# Altium schematic sheet RFFE.SchDoc
size A3
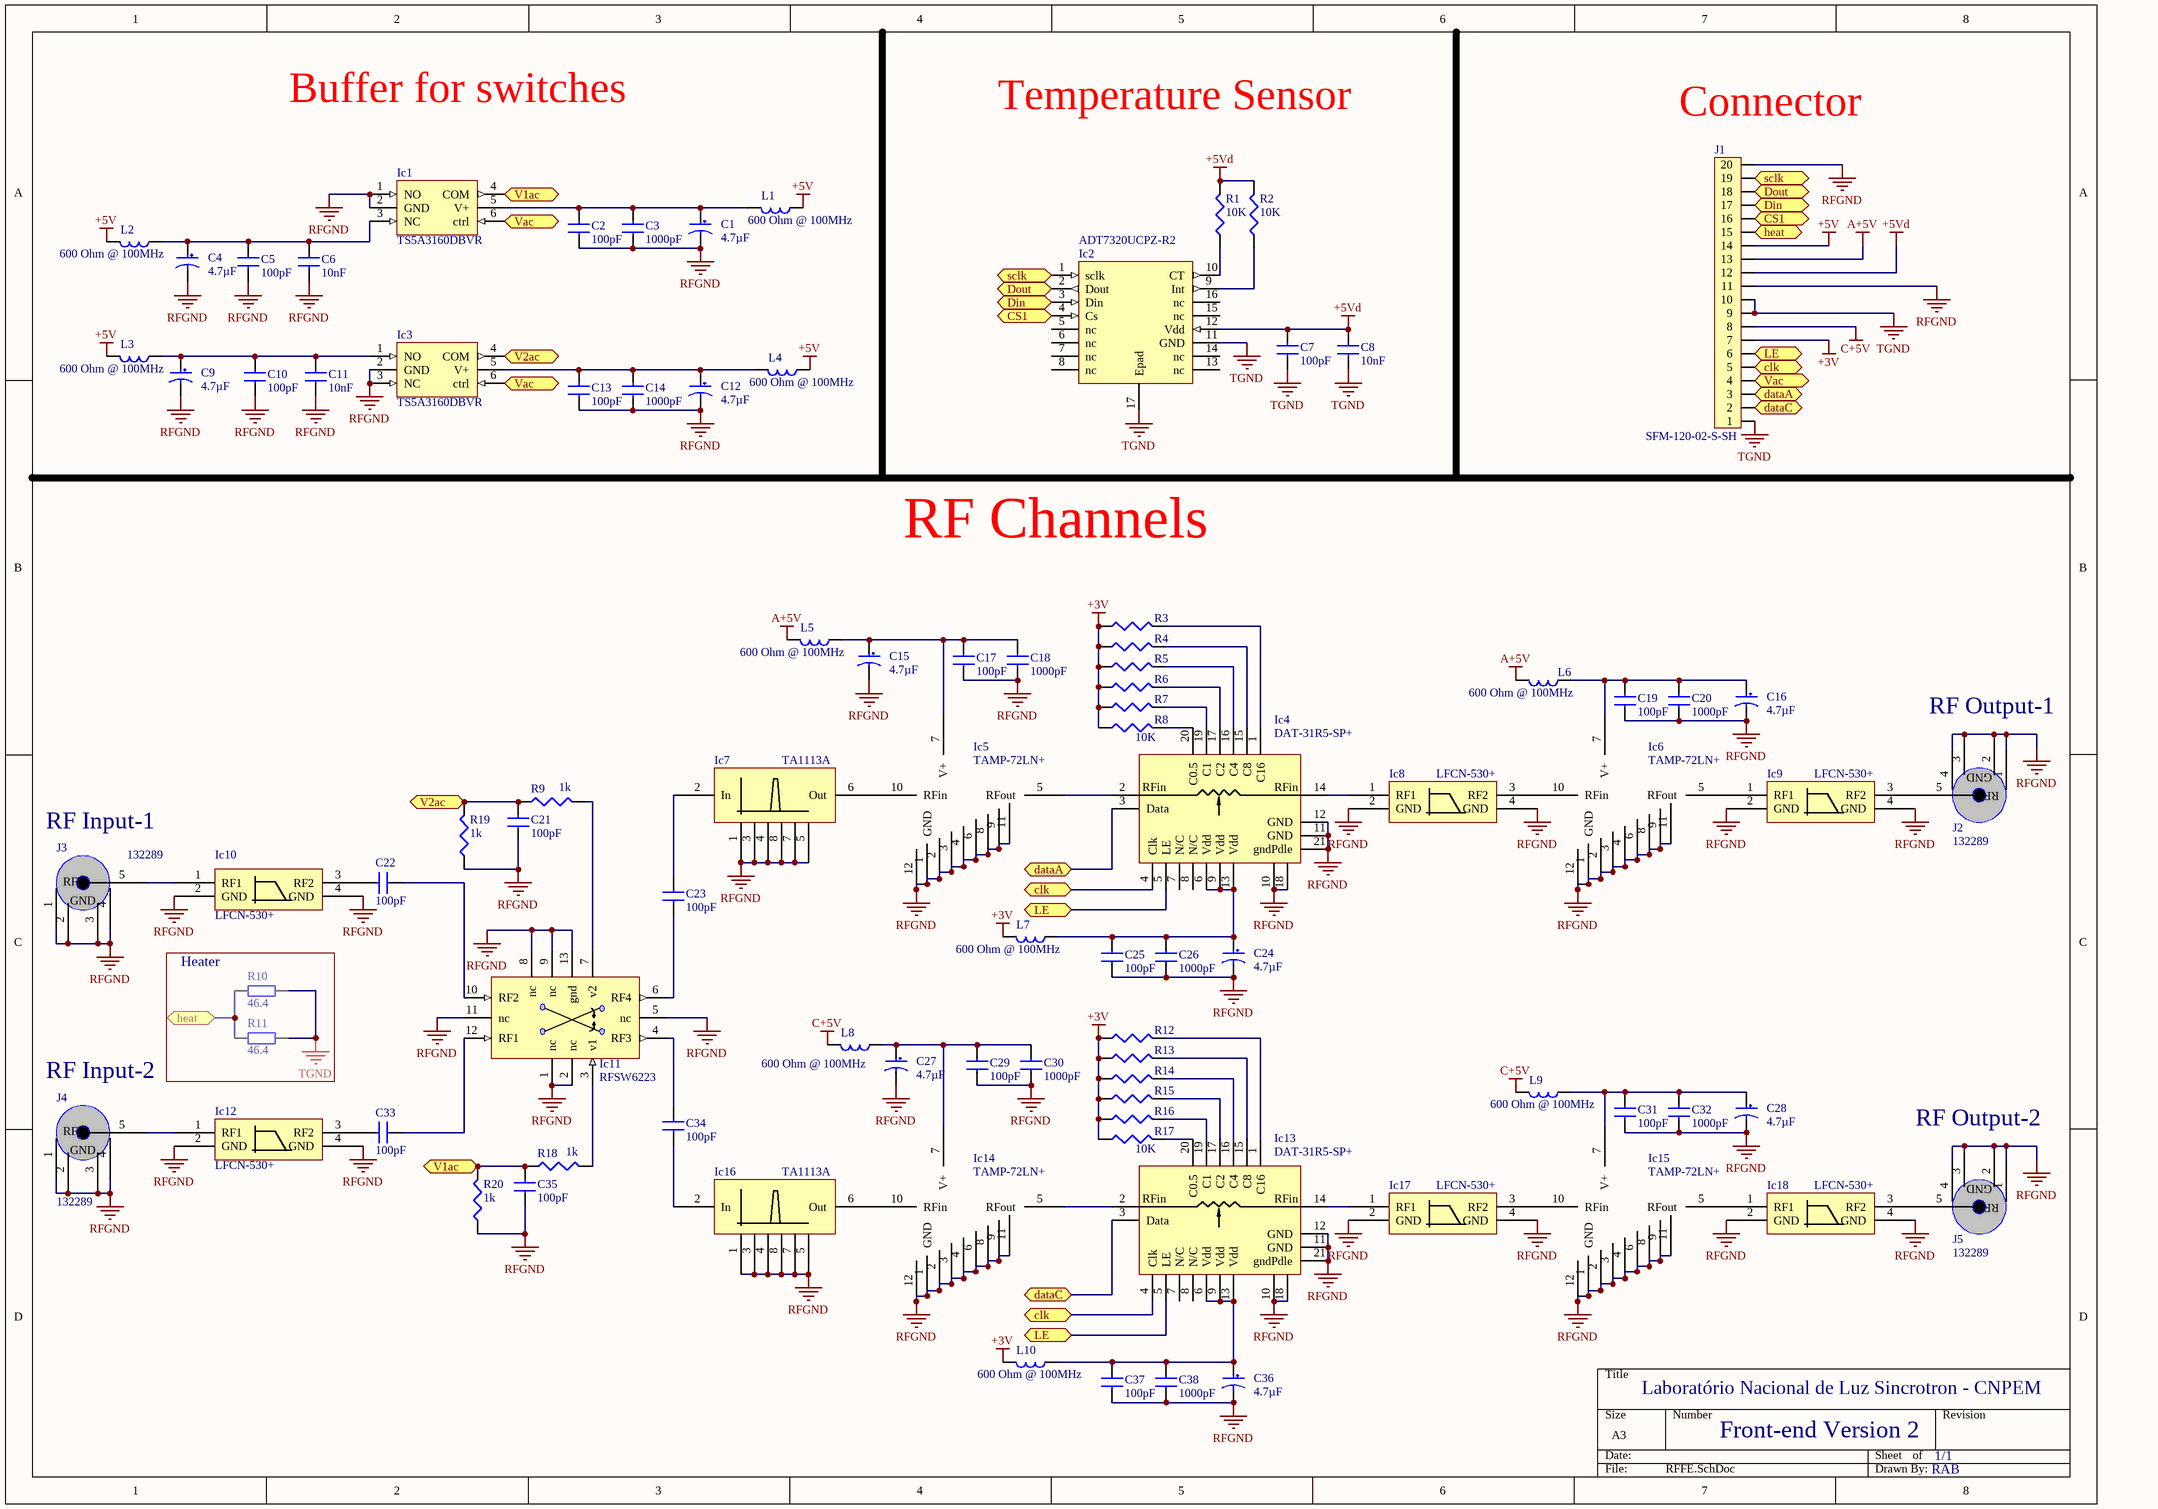
[diagram p0: RFFE.SchDoc]

## Parts
C1  Capacitance: 4.7µF  [CAPC3528M]  (hidden comment: CAP TANT 4.7UF)
C2  Capacitance: 100pF  [CAPC1608M]  (hidden comment: C1608C0G1H101J)
C3  Capacitance: 1000pF  [CAPC1608M]  (hidden comment: C1608C0G1H102J)
C4  Capacitance: 4.7µF  [CAPC3528M]  (hidden comment: CAP TANT 4.7UF)
C5  Capacitance: 100pF  [CAPC1005M]  (hidden comment: UMK105CG101JV-F)
C6  Capacitance: 10nF  [CAPC2012M]  (hidden comment: CAP CER 10000PF)
C7  Capacitance: 100pF  [CAPC1608N]  (hidden comment: C1608C0G1H101J)
C8  Capacitance: 10nF  [CAPC2012M]  (hidden comment: CAP CER 10000PF)
C9  Capacitance: 4.7µF  [CAPC3528M]  (hidden comment: CAP TANT 4.7UF)
C10  Capacitance: 100pF  [CAPC1005M]  (hidden comment: UMK105CG101JV-F)
C11  Capacitance: 10nF  [CAPC2012M]  (hidden comment: CAP CER 10000PF)
C12  Capacitance: 4.7µF  [CAPC3528M]  (hidden comment: CAP TANT 4.7UF)
C13  Capacitance: 100pF  [CAPC1608M]  (hidden comment: C1608C0G1H101J)
C14  Capacitance: 1000pF  [CAPC1608M]  (hidden comment: C1608C0G1H102J)
C15  Capacitance: 4.7µF  [CAPC3528M]  (hidden comment: CAP TANT 4.7UF)
C16  Capacitance: 4.7µF  [CAPC3528M]  (hidden comment: CAP TANT 4.7UF)
C17  Capacitance: 100pF  [CAPC1608N]  (hidden comment: C1608C0G1H101J)
C18  Capacitance: 1000pF  [CAPC1608M]  (hidden comment: C1608C0G1H102J)
C19  Capacitance: 100pF  [CAPC1608N]  (hidden comment: C1608C0G1H101J)
C20  Capacitance: 1000pF  [CAPC1608M]  (hidden comment: C1608C0G1H102J)
C21  Capacitance: 100pF  [CAPC1608N]  (hidden comment: C1608C0G1H101J)
C22  Capacitance: 100pF  [CAPC1005N]  (hidden comment: UMK105CG101JV-F)
C23  Capacitance: 100pF  [CAPC1005N]  (hidden comment: UMK105CG101JV-F)
C24  Capacitance: 4.7µF  [CAPC3528M]  (hidden comment: CAP TANT 4.7UF)
C25  Capacitance: 100pF  [CAPC1608N]  (hidden comment: C1608C0G1H101J)
C26  Capacitance: 1000pF  [CAPC1608M]  (hidden comment: C1608C0G1H102J)
C27  Capacitance: 4.7µF  [CAPC3528M]  (hidden comment: CAP TANT 4.7UF)
C28  Capacitance: 4.7µF  [CAPC3528M]  (hidden comment: CAP TANT 4.7UF)
C29  Capacitance: 100pF  [CAPC1608N]  (hidden comment: C1608C0G1H101J)
C30  Capacitance: 1000pF  [CAPC1608M]  (hidden comment: C1608C0G1H102J)
C31  Capacitance: 100pF  [CAPC1608N]  (hidden comment: C1608C0G1H101J)
C32  Capacitance: 1000pF  [CAPC1608M]  (hidden comment: C1608C0G1H102J)
C33  Capacitance: 100pF  [CAPC1005N]  (hidden comment: UMK105CG101JV-F)
C34  Capacitance: 100pF  [CAPC1005N]  (hidden comment: UMK105CG101JV-F)
C35  Capacitance: 100pF  [CAPC1608N]  (hidden comment: C1608C0G1H101J)
C36  Capacitance: 4.7µF  [CAPC3528M]  (hidden comment: CAP TANT 4.7UF)
C37  Capacitance: 100pF  [CAPC1608N]  (hidden comment: C1608C0G1H101J)
C38  Capacitance: 1000pF  [CAPC1608M]  (hidden comment: C1608C0G1H102J)
Ic1  TS5A3160DBVR  [TSOP95P280X145-6N]
Ic2  ADT7320UCPZ-R2  [QFN127P600-8N]
Ic3  TS5A3160DBVR  [TSOP95P280X145-6N]
Ic4  DAT-31R5-SP+  [DG983-1]
Ic5  TAMP-72LN+  [JQ1382]
Ic6  TAMP-72LN+  [JQ1382]
Ic7  TA1113A  [TST-TA1114A]
Ic8  LFCN-530+  [FV1206]
Ic9  LFCN-530+  [FV1206]
Ic10  LFCN-530+  [FV1206]
Ic11  RFSW6223  [QFN50P300X300X85_HS-13N1]
Ic12  LFCN-530+  [FV1206]
Ic13  DAT-31R5-SP+  [DG983-1]
Ic14  TAMP-72LN+  [JQ1382]
Ic15  TAMP-72LN+  [JQ1382]
Ic16  TA1113A  [TST-TA1114A]
Ic17  LFCN-530+  [FV1206]
Ic18  LFCN-530+  [FV1206]
J1  SFM-120-02-S-SH  [SFM-120-02-S-SH]
J2  132289  [SMAedge50R]
J3  132289  [SMAedge50R]
J4  132289  [SMAedge50R]
J5  132289  [SMAedge50R]
L1  Impedance @ Frequency: 600 Ohm @ 100MHz  [CAPC1608M]  (hidden comment: BLM18HE601SN1D)
L2  Impedance @ Frequency: 600 Ohm @ 100MHz  [CAPC1608M]  (hidden comment: BLM18HE601SN1D)
L3  Impedance @ Frequency: 600 Ohm @ 100MHz  [CAPC1608M]  (hidden comment: BLM18HE601SN1D)
L4  Impedance @ Frequency: 600 Ohm @ 100MHz  [CAPC1608M]  (hidden comment: BLM18HE601SN1D)
L5  Impedance @ Frequency: 600 Ohm @ 100MHz  [CAPC1608M]  (hidden comment: BLM18HE601SN1D)
L6  Impedance @ Frequency: 600 Ohm @ 100MHz  [CAPC1608M]  (hidden comment: BLM18HE601SN1D)
L7  Impedance @ Frequency: 600 Ohm @ 100MHz  [CAPC1608M]  (hidden comment: BLM18HE601SN1D)
L8  Impedance @ Frequency: 600 Ohm @ 100MHz  [CAPC1608M]  (hidden comment: BLM18HE601SN1D)
L9  Impedance @ Frequency: 600 Ohm @ 100MHz  [CAPC1608M]  (hidden comment: BLM18HE601SN1D)
L10  Impedance @ Frequency: 600 Ohm @ 100MHz  [CAPC1608M]  (hidden comment: BLM18HE601SN1D)
R1  Resistance (Ohms): 10K  [RESC1608N]  (hidden comment: PNM0603E1002BST5)
R2  Resistance (Ohms): 10K  [RESC1608N]  (hidden comment: PNM0603E1002BST5)
R3  ERJ-3GEYJ103V  [RESC1608N]  (value not drawn)
R4  ERJ-3GEYJ103V  [RESC1608N]  (value not drawn)
R5  ERJ-3GEYJ103V  [RESC1608N]  (value not drawn)
R6  ERJ-3GEYJ103V  [RESC1608N]  (value not drawn)
R7  ERJ-3GEYJ103V  [RESC1608N]  (value not drawn)
R8  Resistance (Ohms): 10K  [RESC1608N]  (hidden comment: ERJ-3GEYJ103V)
R9  Resistance (Ohms): 1k  [RESC1005L]  (hidden comment: ERJ-2GEJ102X)
R10  Resistance (Ohms): 46.4  [AXIAL9.0]  (hidden comment: CMF5546R400FHEB)
R11  Resistance (Ohms): 46.4  [AXIAL9.0]  (hidden comment: CMF5546R400FHEB)
R12  ERJ-3GEYJ103V  [RESC1608N]  (value not drawn)
R13  ERJ-3GEYJ103V  [RESC1608N]  (value not drawn)
R14  ERJ-3GEYJ103V  [RESC1608N]  (value not drawn)
R15  ERJ-3GEYJ103V  [RESC1608N]  (value not drawn)
R16  ERJ-3GEYJ103V  [RESC1608N]  (value not drawn)
R17  Resistance (Ohms): 10K  [RESC1608N]  (hidden comment: ERJ-3GEYJ103V)
R18  Resistance (Ohms): 1k  [RESC1005L]  (hidden comment: ERJ-2GEJ102X)
R19  Resistance (Ohms): 1k  [RESC1005L]  (hidden comment: ERJ-2GEJ102X)
R20  Resistance (Ohms): 1k  [RESC1005L]  (hidden comment: ERJ-2GEJ102X)

## Blocks framed on the sheet
Heater: R10 R11

## Ports
clk, CS1, dataA, dataC, Din, Dout, heat, LE, sclk, V1ac, V2ac, Vac

## Nets
+3V: J1.7 L7.2 L10.2 R3.2 R4.2 R5.2 R6.2 R7.2 R8.2 R12.2 R13.2 R14.2 R15.2 R16.2 R17.2
+5V: J1.14 L1.1 L2.2 L3.2 L4.1
+5Vd: C7.2 C8.1 Ic2.12(Vdd) J1.12 R1.1 R2.1
A+5V: J1.13 L5.2 L6.2
C+5V: J1.8 L8.2 L9.2
RFGND: C1.2 C2.1 C3.2 C4.2 C5.2 C6.2 C9.2 C10.2 C11.2 C12.2 C13.1 C14.2 C15.2 C16.2 C17.1 C18.2 C19.1 C20.2 C21.1 C24.2 C25.1 C26.2 C27.2 C28.2 C29.1 C30.2 C31.1 C32.2 C35.1 C36.2 C37.1 C38.2 Ic1.1(NO) Ic1.2(GND) Ic3.2(GND) Ic3.3(NC) Ic4.10(GND) Ic4.11(GND) Ic4.12(GND) Ic4.18(GND) Ic4.21(gndPdle) Ic5.1(GND) Ic5.2(GND) Ic5.3(GND) Ic5.4(GND) Ic5.6(GND) Ic5.8(GND) Ic5.9(GND) Ic5.11(GND) Ic5.12(GND) Ic6.1(GND) Ic6.2(GND) Ic6.3(GND) Ic6.4(GND) Ic6.6(GND) Ic6.8(GND) Ic6.9(GND) Ic6.11(GND) Ic6.12(GND) Ic7.1(GND) Ic7.3(GND) Ic7.4(GND) Ic7.5(GND) Ic7.7(GND) Ic7.8(GND) Ic8.2(GND) Ic8.4(GND) Ic9.2(GND) Ic9.4(GND) Ic10.2(GND) Ic10.4(GND) Ic11.1(nc) Ic11.2(nc) Ic11.5(nc) Ic11.8(nc) Ic11.9(nc) Ic11.11(nc) Ic11.13(gnd) Ic12.2(GND) Ic12.4(GND) Ic13.10(GND) Ic13.11(GND) Ic13.12(GND) Ic13.18(GND) Ic13.21(gndPdle) Ic14.1(GND) Ic14.2(GND) Ic14.3(GND) Ic14.4(GND) Ic14.6(GND) Ic14.8(GND) Ic14.9(GND) Ic14.11(GND) Ic14.12(GND) Ic15.1(GND) Ic15.2(GND) Ic15.3(GND) Ic15.4(GND) Ic15.6(GND) Ic15.8(GND) Ic15.9(GND) Ic15.11(GND) Ic15.12(GND) Ic16.1(GND) Ic16.3(GND) Ic16.4(GND) Ic16.5(GND) Ic16.7(GND) Ic16.8(GND) Ic17.2(GND) Ic17.4(GND) Ic18.2(GND) Ic18.4(GND) J1.11 J1.20 J2.1(GND) J2.2(GND) J2.3(GND) J2.4(GND) J3.1(GND) J3.2(GND) J3.3(GND) J3.4(GND) J4.1(GND) J4.2(GND) J4.3(GND) J4.4(GND) J5.1(GND) J5.2(GND) J5.3(GND) J5.4(GND) R19.2 R20.2
TGND: C7.1 C8.2 Ic2.11(GND) Ic2.17(Epad) J1.1 J1.9 J1.10 R10.1 R11.1
clk: Ic4.4(Clk) Ic13.4(Clk) J1.5 ; port clk
CS1: Ic2.4(Cs) J1.16 ; port CS1
dataA: Ic4.3(Data) J1.3 ; port dataA
dataC: Ic13.3(Data) J1.2 ; port dataC
Din: Ic2.3(Din) J1.17 ; port Din
Dout: Ic2.2(Dout) J1.18 ; port Dout
heat: J1.15 R10.2 R11.2 ; port heat
LE: Ic4.5(LE) Ic13.5(LE) J1.6 ; port LE
sclk: Ic2.1(sclk) J1.19 ; port sclk
V1ac: C35.2 Ic1.4(COM) R18.2 R20.1 ; port V1ac
V2ac: C21.2 Ic3.4(COM) R9.2 R19.1 ; port V2ac
Vac: Ic1.6(ctrl) Ic3.6(ctrl) J1.4 ; port Vac
NetC1_1: C1.1 C2.2 C3.1 Ic1.5(V+) L1.2
NetC4_1: C4.1 C5.1 C6.1 Ic1.3(NC) L2.1
NetC9_1: C9.1 C10.1 C11.1 Ic3.1(NO) L3.1
NetC12_1: C12.1 C13.2 C14.1 Ic3.5(V+) L4.2
NetC15_1: C15.1 C17.2 C18.1 Ic5.7(V+) L5.1
NetC16_1: C16.1 C19.2 C20.1 Ic6.7(V+) L6.1
NetC22_1: C22.1 Ic10.3(RF2)
NetC22_2: C22.2 Ic11.10(RF2)
NetC23_1: C23.1 Ic7.2(In)
NetC23_2: C23.2 Ic11.6(RF4)
NetC24_1: C24.1 C25.2 C26.1 Ic4.6(Vdd) Ic4.9(Vdd) Ic4.13(Vdd) L7.1
NetC27_1: C27.1 C29.2 C30.1 Ic14.7(V+) L8.1
NetC28_1: C28.1 C31.2 C32.1 Ic15.7(V+) L9.1
NetC33_1: C33.1 Ic12.3(RF2)
NetC33_2: C33.2 Ic11.12(RF1)
NetC34_1: C34.1 Ic11.4(RF3)
NetC34_2: C34.2 Ic16.2(In)
NetC36_1: C36.1 C37.2 C38.1 Ic13.6(Vdd) Ic13.9(Vdd) Ic13.13(Vdd) L10.1
NetIc2_9: Ic2.9(Int) R2.2
NetIc2_10: Ic2.10(CT) R1.2
NetIc4_1: Ic4.1(C16) R3.1
NetIc4_2: Ic4.2(RFin) Ic5.5(RFout)
NetIc4_14: Ic4.14(RFout) Ic8.1(RF1)
NetIc4_15: Ic4.15(C8) R4.1
NetIc4_16: Ic4.16(C4) R5.1
NetIc4_17: Ic4.17(C2) R6.1
NetIc4_19: Ic4.19(C1) R7.1
NetIc4_20: Ic4.20(C0.5) R8.1
NetIc5_10: Ic5.10(RFin) Ic7.6(Out)
NetIc6_5: Ic6.5(RFout) Ic9.1(RF1)
NetIc6_10: Ic6.10(RFin) Ic8.3(RF2)
NetIc9_3: Ic9.3(RF2) J2.5(RFin)
NetIc10_1: Ic10.1(RF1) J3.5(RFin)
NetIc11_3: Ic11.3(v1) R18.1
NetIc11_7: Ic11.7(v2) R9.1
NetIc12_1: Ic12.1(RF1) J4.5(RFin)
NetIc13_1: Ic13.1(C16) R12.1
NetIc13_2: Ic13.2(RFin) Ic14.5(RFout)
NetIc13_14: Ic13.14(RFout) Ic17.1(RF1)
NetIc13_15: Ic13.15(C8) R13.1
NetIc13_16: Ic13.16(C4) R14.1
NetIc13_17: Ic13.17(C2) R15.1
NetIc13_19: Ic13.19(C1) R16.1
NetIc13_20: Ic13.20(C0.5) R17.1
NetIc14_10: Ic14.10(RFin) Ic16.6(Out)
NetIc15_5: Ic15.5(RFout) Ic18.1(RF1)
NetIc15_10: Ic15.10(RFin) Ic17.3(RF2)
NetIc18_3: Ic18.3(RF2) J5.5(RFin)

Not connected (* = marked no-connect by the designer): Ic2 5(nc) 6(nc) 7(nc) 8(nc) 13(nc) 14(nc) 15(nc) 16(nc); Ic4 7(N/C) 8(N/C); Ic5 0(GND); Ic6 0(GND); Ic13 7(N/C) 8(N/C); Ic14 0(GND); Ic15 0(GND)

## Notes on the sheet
- Buffer for switches
- Temperature Sensor
- (near J1) Connector
- RF Channels
- RF Output-1
- RF Input-1
- RF Input-2
- RF Output-2
- Laboratório Nacional de Luz Sincrotron - CNPEM
- Front-end Version 2
- 1/1
- RAB
- (in symbol 132289) RF

## Library data of the parts
C1 C4 C9 C12 C15 C16 C24 C27 C28 C36 = T495B475K016ZTE800: CAP TANT 4.7UF 16V 10% 1411; Manufacturer: Kemet; Manufacturer Size Code: B; ESR (Equivalent Series Resistance): 800.0 mOhm; Type: Molded; Supplier 1: Digi-Key; Manufacturer Part Number: T495B475K016ZTE800; RoHS: RoHS Compliant; Category: Capacitors; Stock 1: 4639; Pricing 1: 1=2.2, 10=1.804, 25=1.628, 100=1.452, 250=1.276, 500=1.188, 1000=0.924 (USD); Voltage - Rated: 16V; Tolerance: ±10%; Operating Temperature: -55°C ~ 125°C; Mounting Type: Surface Mount; Package / Case: 1411 (3528 Metric); Size / Dimension: 0.138" L x 0.110" W (3.50mm x 2.80mm); Height - Seated (Max): 0.083" (2.10mm); Lead Spacing: -; Features: General Purpose; Packaging: Cut Tape (CT); Lifetime @ Temp.: -; ComponentLink1URL: http://www.kemet.com/datasheets&T495B475K016ZTE800; ComponentLink1Description: http://www.kemet.com/datasheets&T495B475K016ZTE800; Supplier Part Number 1: 399-5191-1-ND
C2 C7 C13 C17 C19 C21 C25 C29 C31 C35 C37 = C1608C0G1H101J: CAP CER 100PF 50V 5% NP0 0603; Manufacturer: TDK Corporation; Temperature Coefficient: C0G, NP0; Supplier 1: Digi-Key; Manufacturer Part Number: C1608C0G1H101J; RoHS: RoHS Compliant; Category: Capacitors; Stock 1: 926382; Pricing 1: 1=0.09, 10=0.055, 100=0.0198, 250=0.01432, 500=0.01056, 1000=0.00715 (USD); Voltage - Rated: 50V; Tolerance: ±5%; Mounting Type: Surface Mount, MLCC; Operating Temperature: -55°C ~ 125°C; Applications: General Purpose; Ratings: -; Package / Case: 0603 (1608 Metric); Size / Dimension: 0.063" L x 0.031" W (1.60mm x 0.80mm); Height - Seated (Max): -; Thickness (Max): 0.037" (0.95mm); Lead Spacing: -; Features: -; Packaging: Cut Tape (CT); Lead Style: -; ComponentLink1URL: http://www.tdk.com/pdf/general_B11.pdf; ComponentLink1Description: http://www.tdk.com/pdf/general_B11.pdf; Supplier Part Number 1: 445-1281-1-ND
C3 C14 C18 C20 C26 C30 C32 C38 = C1608C0G1H102J: CAP CER 1000PF 50V 5% NP0 0603; Manufacturer: TDK Corporation; Temperature Coefficient: C0G, NP0; Supplier 1: Digi-Key; Manufacturer Part Number: C1608C0G1H102J; RoHS: RoHS Compliant; Category: Capacitors; Stock 1: 116011; Pricing 1: 1=0.11, 10=0.078, 100=0.0358, 250=0.02924, 500=0.02502, 1000=0.0195 (USD); Voltage - Rated: 50V; Tolerance: ±5%; Mounting Type: Surface Mount, MLCC; Operating Temperature: -55°C ~ 125°C; Applications: General Purpose; Ratings: -; Package / Case: 0603 (1608 Metric); Size / Dimension: 0.063" L x 0.031" W (1.60mm x 0.80mm); Height - Seated (Max): -; Thickness (Max): 0.037" (0.95mm); Lead Spacing: -; Features: -; Packaging: Cut Tape (CT); Lead Style: -; ComponentLink1URL: http://www.tdk.com/pdf/general_B11.pdf; ComponentLink1Description: http://www.tdk.com/pdf/general_B11.pdf; Supplier Part Number 1: 445-1293-1-ND
C5 C10 C22 C23 C33 C34 = UMK105CG101JV-F: CAP CER 100PF 50V 5% NP0 0402; Manufacturer: Taiyo Yuden; Temperature Coefficient: C0G, NP0; Supplier 1: Digi-Key; RoHS: RoHS Compliant; Category: Capacitors; Stock 1: 342495; Pricing 1: 1=0.1, 10=0.017, 50=0.009, 100=0.0077, 250=0.00632, 500=0.00538, 1000=0.0042, 5000=0.0035 (USD); Packaging: Cut Tape (CT); Voltage - Rated: 50V; Tolerance: ±5%; Mounting Type: Surface Mount, MLCC; Operating Temperature: -55°C ~ 125°C; Applications: General Purpose; Ratings: -; Package / Case: 0402 (1005 Metric); Size / Dimension: 0.039" L x 0.020" W (1.00mm x 0.50mm); Height - Seated (Max): -; Thickness (Max): 0.022" (0.55mm); Lead Spacing: -; Features: -; Lead Style: -; ComponentLink1URL: http://media.digikey.com/pdf/Data%20Sheets/Taiyo%20Yuden%20PDFs%20URL%20links/Standard%20Multilayer%20Ceramic%20Caps.pdf; ComponentLink1Description: http://media.digikey.com/pdf/Data%20Sheets/Taiyo%20Yuden%20PDFs%20URL%20links/Standard%20Multilayer%20Ceramic%20Caps.pdf; Supplier Part Number 1: 587-1211-1-ND; Manufacturer Part Number: UMK105CG101JV-F
C6 C8 C11 = C2012C0G1H103J/0.60: CAP CER 10000PF 50V 5% NP0 0805; Manufacturer: TDK Corporation; Temperature Coefficient: C0G, NP0; Supplier 1: Digi-Key; Manufacturer Part Number: C2012C0G1H103J/0.60; RoHS: RoHS Compliant; Category: Capacitors; Stock 1: 7053; Pricing 1: 1=0.46, 10=0.363, 100=0.1898, 250=0.14024, 500=0.1089, 1000=0.0858 (USD); Voltage - Rated: 50V; Tolerance: ±5%; Mounting Type: Surface Mount, MLCC; Operating Temperature: -55°C ~ 125°C; Applications: General Purpose; Ratings: -; Package / Case: 0805 (2012 Metric); Size / Dimension: 0.079" L x 0.049" W (2.00mm x 1.25mm); Height - Seated (Max): -; Thickness (Max): 0.028" (0.70mm); Lead Spacing: -; Features: -; Packaging: Cut Tape (CT); Lead Style: -; ComponentLink1URL: http://www.tdk.com/pdf/general_B11.pdf; ComponentLink1Description: http://www.tdk.com/pdf/general_B11.pdf; Supplier Part Number 1: 445-7519-1-ND
Ic1 Ic3 = TS5A3160DBVR: IC SWITCH SPDT SOT23-6; Manufacturer: Texas Instruments; Circuit: 1 x SPDT; On-State Resistance: 900 mOhm; Voltage Supply Source: Single Supply; Voltage - Supply, Single/Dual (±): 1.65 V ~ 5.5 V; Current - Supply: 10nA; Supplier 1: Digi-Key; RoHS: RoHS Compliant; Category: Integrated Circuits (ICs); Stock 1: 7833; Pricing 1: 1=0.68, 10=0.577, 25=0.5056, 100=0.4326, 250=0.3752, 500=0.3178, 1000=0.245 (USD); Packaging: Digi-Reel®; Function: Switch; Operating Temperature: -40°C ~ 85°C; Mounting Type: Surface Mount; Package / Case: SOT-23-6; Supplier Device Package: SOT-23-6; ComponentLink1URL: http://www.ti.com/lit/ds/symlink/ts5a3160.pdf; ComponentLink1Description: http://www.ti.com/lit/ds/symlink/ts5a3160.pdf; Supplier Part Number 1: 296-21189-6-ND; Manufacturer Part Number: TS5A3160DBVR
Ic2 = ADT7320UCPZ-R2: IC SENSR TEMP 16BIT DGTL 16LFCSP; Manufacturer: Analog Devices Inc; Function: Temp Monitoring System (Sensor); Sensor Type: Internal; Sensing Temperature: -40°C ~ 150°C; Accuracy: ±0.66°C; Topology: ADC (Sigma Delta), Comparator, Register Bank; Output Type: SPI™; Output Alarm: Yes; Output Fan: No; Voltage - Supply: 2.7 V ~ 5.5 V; Supplier 1: Digi-Key; RoHS: RoHS Compliant; Category: Integrated Circuits (ICs); Stock 1: 480; Pricing 1: 1=7.64, 10=6.87, 25=6.2476, 100=5.6555 (USD); Packaging: Digi-Reel®; Operating Temperature: -40°C ~ 150°C; Mounting Type: Surface Mount; Package / Case: 16-WQFN Exposed Pad, CSP; Supplier Device Package: 16-LFCSP-WQ (4x4); ComponentLink1URL: http://www.analog.com/static/imported-files/data_sheets/ADT7320.pdf; ComponentLink1Description: http://www.analog.com/static/imported-files/data_sheets/ADT7320.pdf; Supplier Part Number 1: ADT7320UCPZ-R2DKR-ND; Manufacturer Part Number: ADT7320UCPZ-R2
Ic4 Ic13 = Minicircuits-DAT-31R5-SP+: Serial Digital Step Attenuator 31.5 step:0.5dB; Manufacturer: Minicircuits; ComponentLink1Description: http://www.minicircuits.com/pdfs/DAT-31R5-SP+.pdf; Manufacturer Part Number: DAT-31R5-SP+; ComponentLink1URL: http://www.minicircuits.com/pdfs/DAT-31R5-SP+.pdf
Ic5 Ic6 Ic14 Ic15 = Minicircuits-TAMP-72LN+: LNA 20 dB Low Noise Figure; ComponentLink1Description: http://www.minicircuits.com/pdfs/TAMP-72LN+.pdf; Manufacturer: Minicircuits; Manufacturer Part Number: TAMP-72LN+; ComponentLink1URL: http://www.minicircuits.com/pdfs/TAMP-72LN+.pdf
Ic7 Ic16 = TST_TA1113A: Manufacturer: Tai-Saw Technology Co; Manufacturer Part Number: TA1113A; ComponentLink1URL: http://www.taisaw.com/upload/product/TA1113A%20_Rev.1.0_.pdf; ComponentLink1Description: http://www.taisaw.com/upload/product/TA1113A%20_Rev.1.0_.pdf
Ic8-Ic10 Ic12 Ic17 Ic18 = Minicircuits-LFCN-530+: Low Pass Filter 3dB@530MHz; ComponentLink1Description: http://www.minicircuits.com/pdfs/LFCN-530.pdf; Manufacturer: Minicircuits; Manufacturer Part Number: LFCN-530+; ComponentLink1URL: http://www.minicircuits.com/pdfs/LFCN-530.pdf
Ic11 = RFMD_RFSW6223: CrossbarSwitch; Manufacturer: RFMD; Manufacturer Part Number: RFSW6223; ComponentLink1URL: http://www.rfmw.com/datasheets/rfmd/rfsw6223.pdf; ComponentLink1Description: http://www.rfmw.com/datasheets/rfmd/rfsw6223.pdf
J1 = SFM-120-02-S-SH: Manufacturer: SAMTEC; Product Range: SAMTEC - TFM Series; Contact Termination: Through Hole Right Angle; Gender: Receptacle; SVHC: No SVHC (20-Jun-2013); Pitch Spacing: 1.27; No. of Rows: 1; No. of Contacts: 20; Contact Material: Phosphor Bronze; Contact Plating: Gold; RoHS: YES; Stock: 100; Manufacturer Part Number: SFM-120-02-S-SH
J2-J5 = 132289: CONN SMA JACK 50 OHM EDGE MNT; Manufacturer: Amphenol Connex; Connector Type: Jack, Female Socket; Contact Termination: Solder; Impedance: 50 Ohm; Frequency - Max: 18GHz; Body Material: Brass; Body Finish: Gold; Center Contact Material: Beryllium Copper; Dielectric Material: Polytetrafluoroethylene (PTFE); Supplier 1: Digi-Key; RoHS: RoHS Compliant; Category: Connectors, Interconnects; Stock 1: 2778; Pricing 1: 1=5.93, 10=5.681, 100=4.693, 250=4.199, 500=3.952, 1000=3.458, 5000=3.25 (USD); Packaging: Bulk; Connector Style: SMA; Shield Termination: Solder; Mounting Type: Board Edge, End Launch; Panel Mount, Bulkhead; Cable Group: -; Fastening Type: Threaded; Features: -; Housing Color: Gold; Ingress Protection: -; Center Contact Plating: Gold; Voltage Rating: -; Operating Temperature: -65°C ~ 165°C; ComponentLink1URL: http://www.amphenolconnex.com/media/downloads/4142/132289.pdf; ComponentLink1Description: http://www.amphenolconnex.com/media/downloads/4142/132289.pdf; Supplier Part Number 1: ACX1426-ND; Manufacturer Part Number: 132289
L1-L10 = BLM18HE601SN1D: FERRITE CHIP 600 OHM 800MA 0603; Manufacturer: Murata Electronics North America; DC Resistance (DCR): 250 mOhm Max; Filter Type: Differential Mode - Single; Supplier 1: Digi-Key; Manufacturer Part Number: BLM18HE601SN1D; RoHS: RoHS Compliant; Category: Filters; Stock 1: 35848; Pricing 1: 1=0.41, 10=0.319, 50=0.21, 100=0.1665, 250=0.12308, 500=0.09556, 1000=0.0753 (USD); Current Rating: 800mA; Package / Case: 0603 (1608 Metric); Mounting Type: Surface Mount; Packaging: Cut Tape (CT); Height (Max): 0.037" (0.95mm); Size / Dimension: 0.063" L x 0.031" W (1.60mm x 0.80mm); ComponentLink1URL: http://search.murata.co.jp/Ceramy/image/img/PDF/ENG/L0110S0101BLM18H.pdf; ComponentLink1Description: http://search.murata.co.jp/Ceramy/image/img/PDF/ENG/L0110S0101BLM18H.pdf; Supplier Part Number 1: 490-5214-1-ND
R1 R2 = PNM0603E1002BST5: RES 10K OHM .15W 0.1% 0603 SMD; Manufacturer: Vishay Thin Film; Power (Watts): 0.15W; Temperature Coefficient: ±25ppm/°C; Supplier 1: Digi-Key; Manufacturer Part Number: PNM0603E1002BST5; RoHS: RoHS Compliant; Category: Resistors; Stock 1: 780; Pricing 1: 1=3.42, 25=2.85, 100=2.47, 250=2.185 (USD); Composition: Thin Film; Features: Moisture Resistant, Non-Inductive, Non-Magnetic; Tolerance: ±0.1%; Package / Case: 0603 (1608 Metric); Size / Dimension: 0.064" L x 0.032" W (1.63mm x 0.81mm); Height: 0.020" (0.51mm); Number of Terminations: 2; Packaging: Cut Tape (CT); ComponentLink1URL: http://www.vishay.com/docs/60057/pnm.pdf; ComponentLink1Description: http://www.vishay.com/docs/60057/pnm.pdf; Supplier Part Number 1: PNM0603-10KBCT-ND
R3-R8 R12-R17 = ERJ-3GEYJ103V: RES 10K OHM 1/10W 5% 0603 SMD; Manufacturer: Panasonic - ECG; Power (Watts): 0.1W, 1/10W; Temperature Coefficient: ±200ppm/°C; Supplier 1: Digi-Key; Manufacturer Part Number: ERJ-3GEYJ103V; RoHS: RoHS Compliant; Category: Resistors; Stock 1: 13981989; Pricing 1: 1=0.1, 50=0.0092, 100=0.007, 250=0.0052, 500=0.00384, 1000=0.00256 (USD); Composition: Thick Film; Features: -; Tolerance: ±5%; Package / Case: 0603 (1608 Metric); Size / Dimension: 0.063" L x 0.031" W (1.60mm x 0.80mm); Height: 0.022" (0.55mm); Number of Terminations: 2; Packaging: Cut Tape (CT); ComponentLink1URL: http://industrial.panasonic.com/www-cgi/jvcr13pz.cgi?E+PZ+3+AOA0001+ERJ3GEYJ103V+7+WW; ComponentLink1Description: http://industrial.panasonic.com/www-cgi/jvcr13pz.cgi?E+PZ+3+AOA0001+ERJ3GEYJ103V+7+WW; Supplier Part Number 1: P10KGCT-ND
  R3-R7 R12-R16: Resistance (Ohms): 10K
R9 R18-R20 = ERJ-2GEJ102X: RES 1K OHM 1/10W 5% 0402 SMD; Manufacturer: Panasonic Electronic Components; Power (Watts): 0.1W, 1/10W; Temperature Coefficient: ±200ppm/°C; Supplier 1: Digi-Key; RoHS: RoHS Compliant; Category: Resistors; Stock 1: 1928812; Pricing 1: 1=0.1, 50=0.0172, 100=0.0131, 250=0.00976, 500=0.0072, 1000=0.0048, 5000=0.00338 (USD); Packaging: Cut Tape (CT); Tolerance: ±5%; Composition: Thick Film; Features: -; Package / Case: 0402 (1005 Metric); Supplier Device Package: 0402; Size / Dimension: 0.039" L x 0.020" W (1.00mm x 0.50mm); Height: 0.016" (0.40mm); Number of Terminations: 2; ComponentLink1URL: http://industrial.panasonic.com/www-cgi/jvcr13pz.cgi?E+PZ+3+AOA0001+ERJ2GEJ102X+7+WW; ComponentLink1Description: http://industrial.panasonic.com/www-cgi/jvcr13pz.cgi?E+PZ+3+AOA0001+ERJ2GEJ102X+7+WW; Supplier Part Number 1: P1.0KJCT-ND; Manufacturer Part Number: ERJ-2GEJ102X
R10 R11 = CMF5546R400FHEB: RES 46.4 OHM 1% 50PPM 1/2W; Manufacturer: Vishay Dale; Power (Watts): 0.5W, 1/2W; Temperature Coefficient: ±50ppm/°C; Supplier 1: Digi-Key; Manufacturer Part Number: CMF5546R400FHEB; RoHS: RoHS Compliant; Category: Resistors; Stock 1: 5609; Pricing 1: 1=0.17, 10=0.149, 50=0.1386, 100=0.132, 250=0.1188, 500=0.1155 (USD); Composition: Metal Film; Features: Flame Retardant Coating; Tolerance: ±1%; Package / Case: Axial; Size / Dimension: 0.090" Dia x 0.278" L (2.29mm x 7.06mm); Height: -; Number of Terminations: 2; Packaging: Cut Tape (CT); ComponentLink1URL: http://www.vishay.com/doc?31018; ComponentLink1Description: http://www.vishay.com/doc?31018; Supplier Part Number 1: CMF46.4HFCT-ND